# Altium project REB215_XPRO_A.PrjPCB
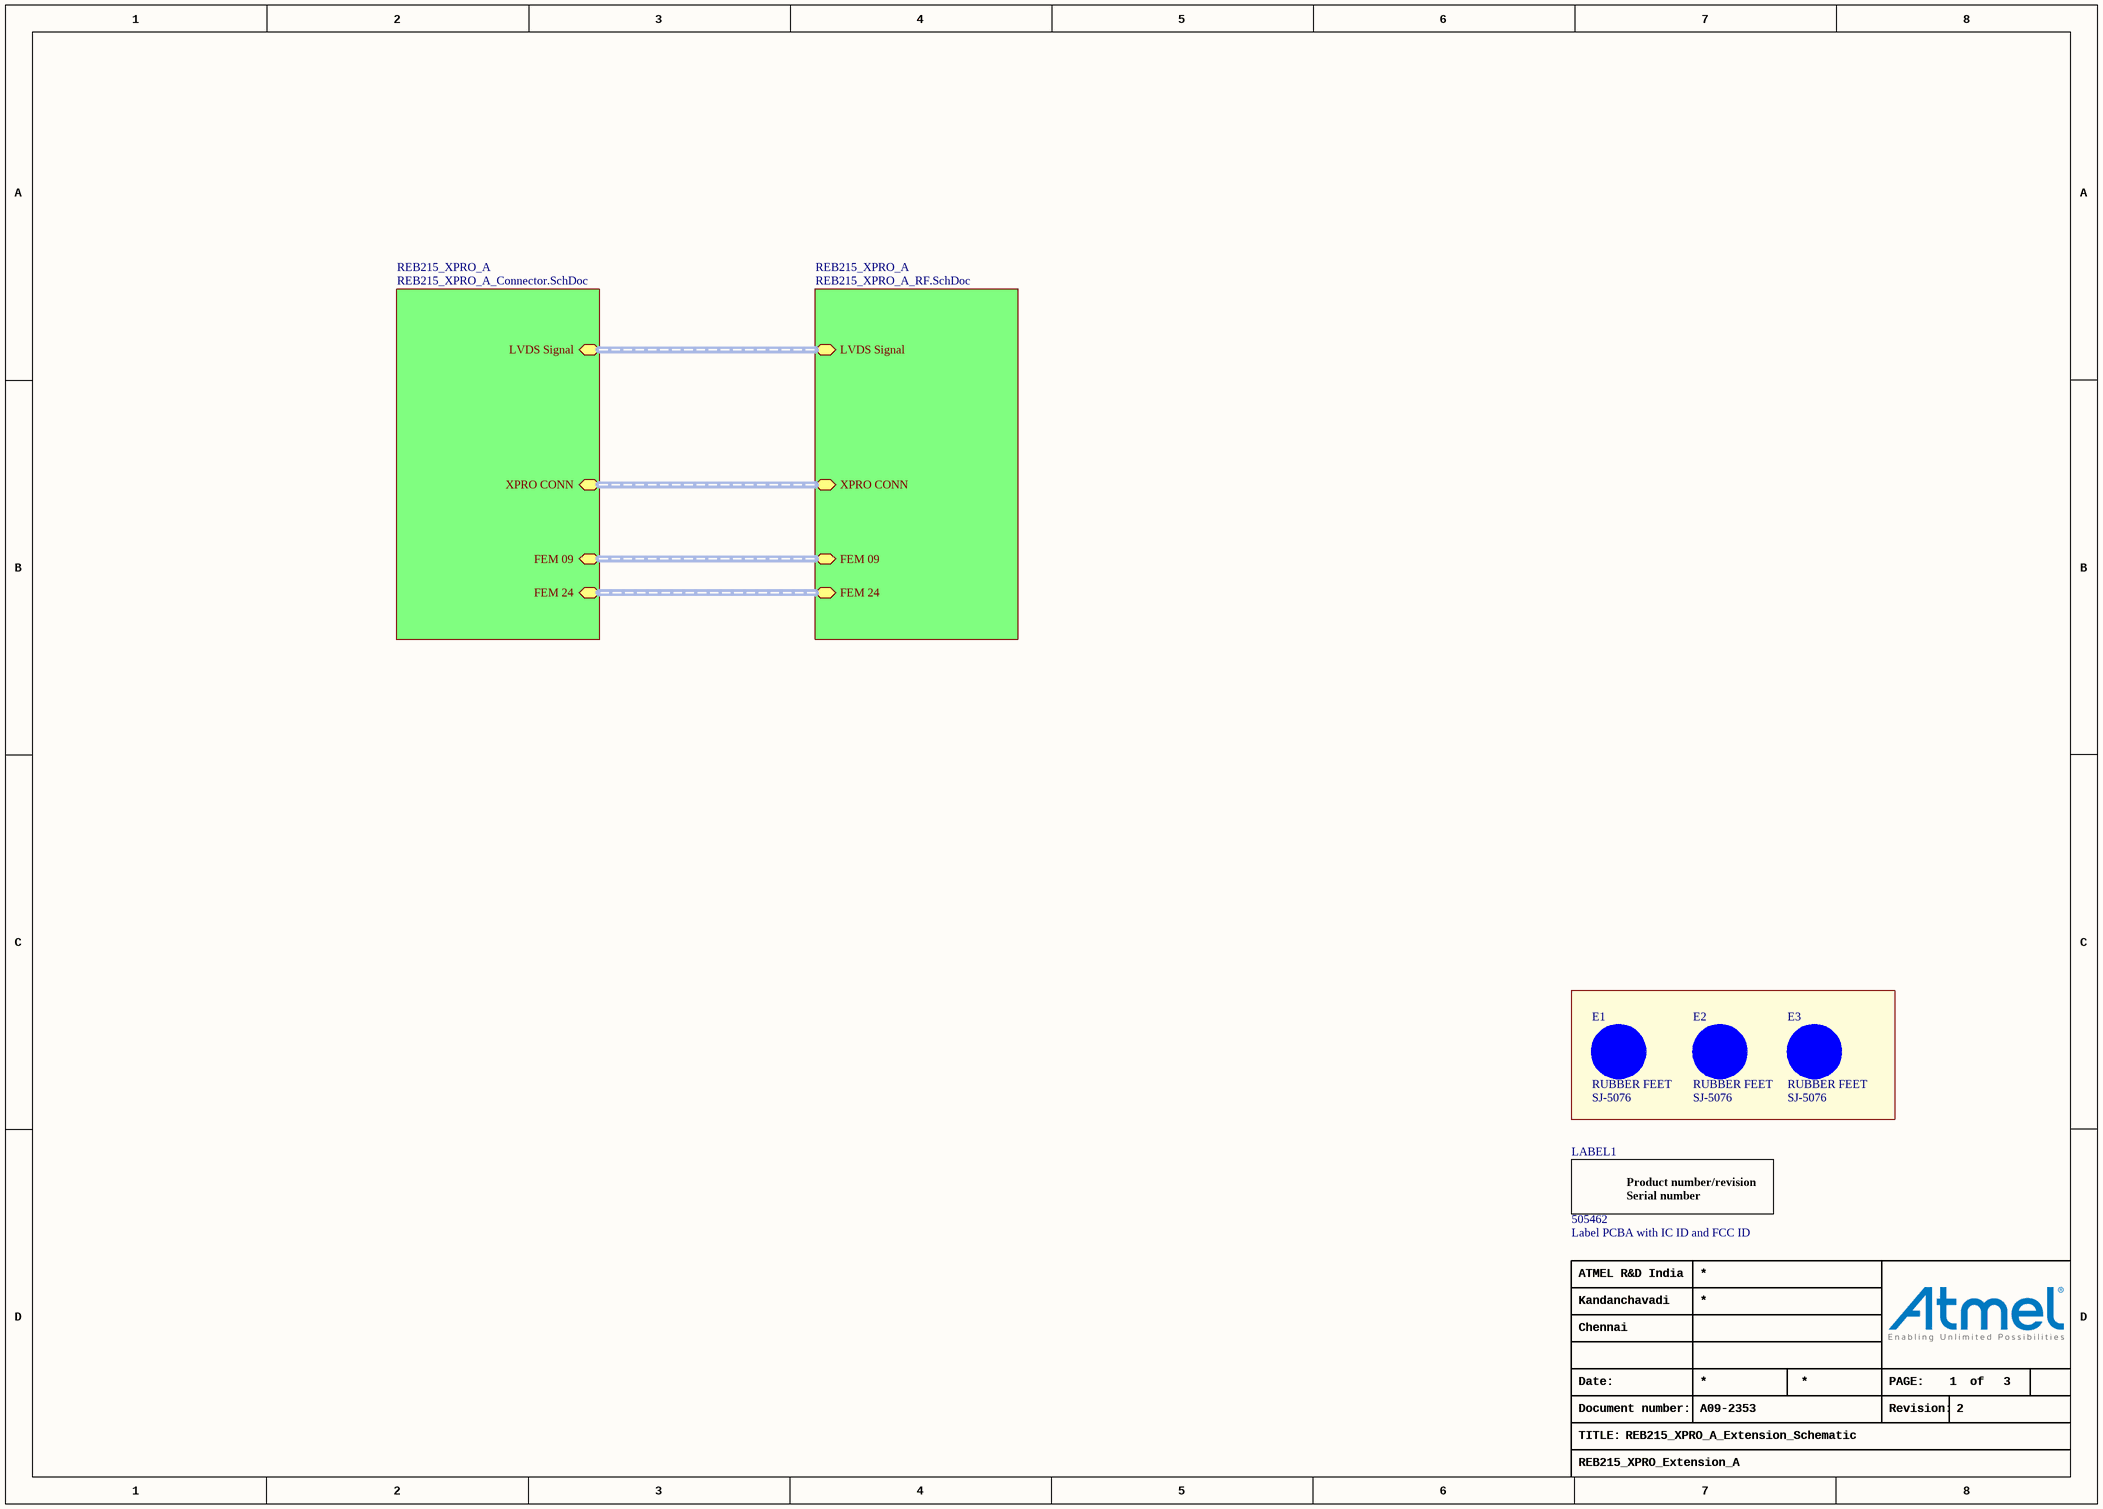
[diagram p0: REB215_XPRO_A_TopLevel.SchDoc]
3 sheets, 79 parts. Net scope: hierarchical (ports join the sheet entries above them; power ports are global).
Board file: REB215_XPRO_A.PcbDoc
Sheets:
  REB215_XPRO_A_TopLevel.SchDoc
    REB215_XPRO_A = REB215_XPRO_A_Connector.SchDoc
    REB215_XPRO_A = REB215_XPRO_A_RF.SchDoc

## Sheet REB215_XPRO_A_TopLevel.SchDoc: REB215_XPRO_A_Extension_Schematic
size A3; Organization: ATMEL R&D India; Address1: Kandanchavadi; Address2: Chennai; DocumentNumber: A09-2353; Revision: 2; SheetNumber: 1; SheetTotal: 3; PageSetup: Record=PageOptions|CenterHorizontal=True|CenterVertical=True|PrintScale=1.01|XCorrection=1.00|YCorrection=1.00|PrintKind=1|BorderSize=5000000|LeftOffset=0|BottomOffset=0|Orientation=2|PaperLength=1000|PaperWidth=1000|Scale=100|PaperSource=7|PrintQuality=-4|MediaType=1|DitherType=10|PaperKind=Letter|PrintScaleMode=1; DocumentName: REB215_XPRO_Extension_A

### Parts
E1  RUBBER FEET  value SJ-5076  [AP8-00192]
E2  RUBBER FEET  value SJ-5076  [AP8-00192]
E3  RUBBER FEET  value SJ-5076  [AP8-00192]
LABEL1  Label PCBA with IC ID and FCC ID  value 505462  [AP8-00317]  (mechanical)

### Sub-sheets
REB215_XPRO_A = REB215_XPRO_A_Connector.SchDoc: LVDS Signal (harness LVDS Signal), XPRO CONN (harness XPRO CONN), FEM 09 (harness FEM 09), FEM 24 (harness FEM 24)
REB215_XPRO_A = REB215_XPRO_A_RF.SchDoc: LVDS Signal (harness LVDS Signal), XPRO CONN (harness XPRO CONN), FEM 09, FEM 24

### Nets

Not connected (* = marked no-connect by the designer): E1 1(FIDUCIAL); E2 1(FIDUCIAL); E3 1(FIDUCIAL)

### Notes on the sheet
- Date:
- PAGE:
- of
- TITLE:
- Document number:
- Revision:
- (in symbol A08-1825) / Product number/revision / Serial number

### Library data of the parts
E1-E3 = A08-0053: 2.8mm adhesive feet,diam 8.0mm; PartGroup: Mechanical devices,Mounting accessories; Manufacturer: 3M; ComponentStatus: 'Active (verified)'; Verified date: 2006-05-05; Verified by: Ketil Skjerve; Status: Active; AN: A08-0053; Height: 2.79999995231628; MPN: SJ-5076; FootprintStatus: 'Active (Verified)'
LABEL1 = A08-1825: Label for use on wireless PCBA that needs IC ID and FCC ID; PartGroup: Mechanical devices,Packaging materials,Printed Labels; Manufacturer: ACT Logimark AS; ComponentStatus: 'Active (verified)'; AN: A08-1825; MPN: 505462; FootprintStatus: 'Active (Verified)'

## Sheet REB215_XPRO_A_Connector.SchDoc: REB215_XPRO_A_Extension_Schematic
size A3; Organization: ATMEL R&D India; Address1: Kandanchavadi; Address3: Chennai; DocumentNumber: A09-2353; Revision: 2; SheetNumber: 2; SheetTotal: 3; PageSetup: Record=PageOptions|CenterHorizontal=True|CenterVertical=True|PrintScale=1.01|XCorrection=1.00|YCorrection=1.00|PrintKind=1|BorderSize=5000000|LeftOffset=0|BottomOffset=0|Orientation=2|PaperLength=1000|PaperWidth=1000|Scale=100|PaperSource=7|PrintQuality=-4|MediaType=1|DitherType=10|PaperKind=A3 (297 x 420 mm)|PrintScaleMode=1; DocumentName: REB215_XPRO_Extension_A
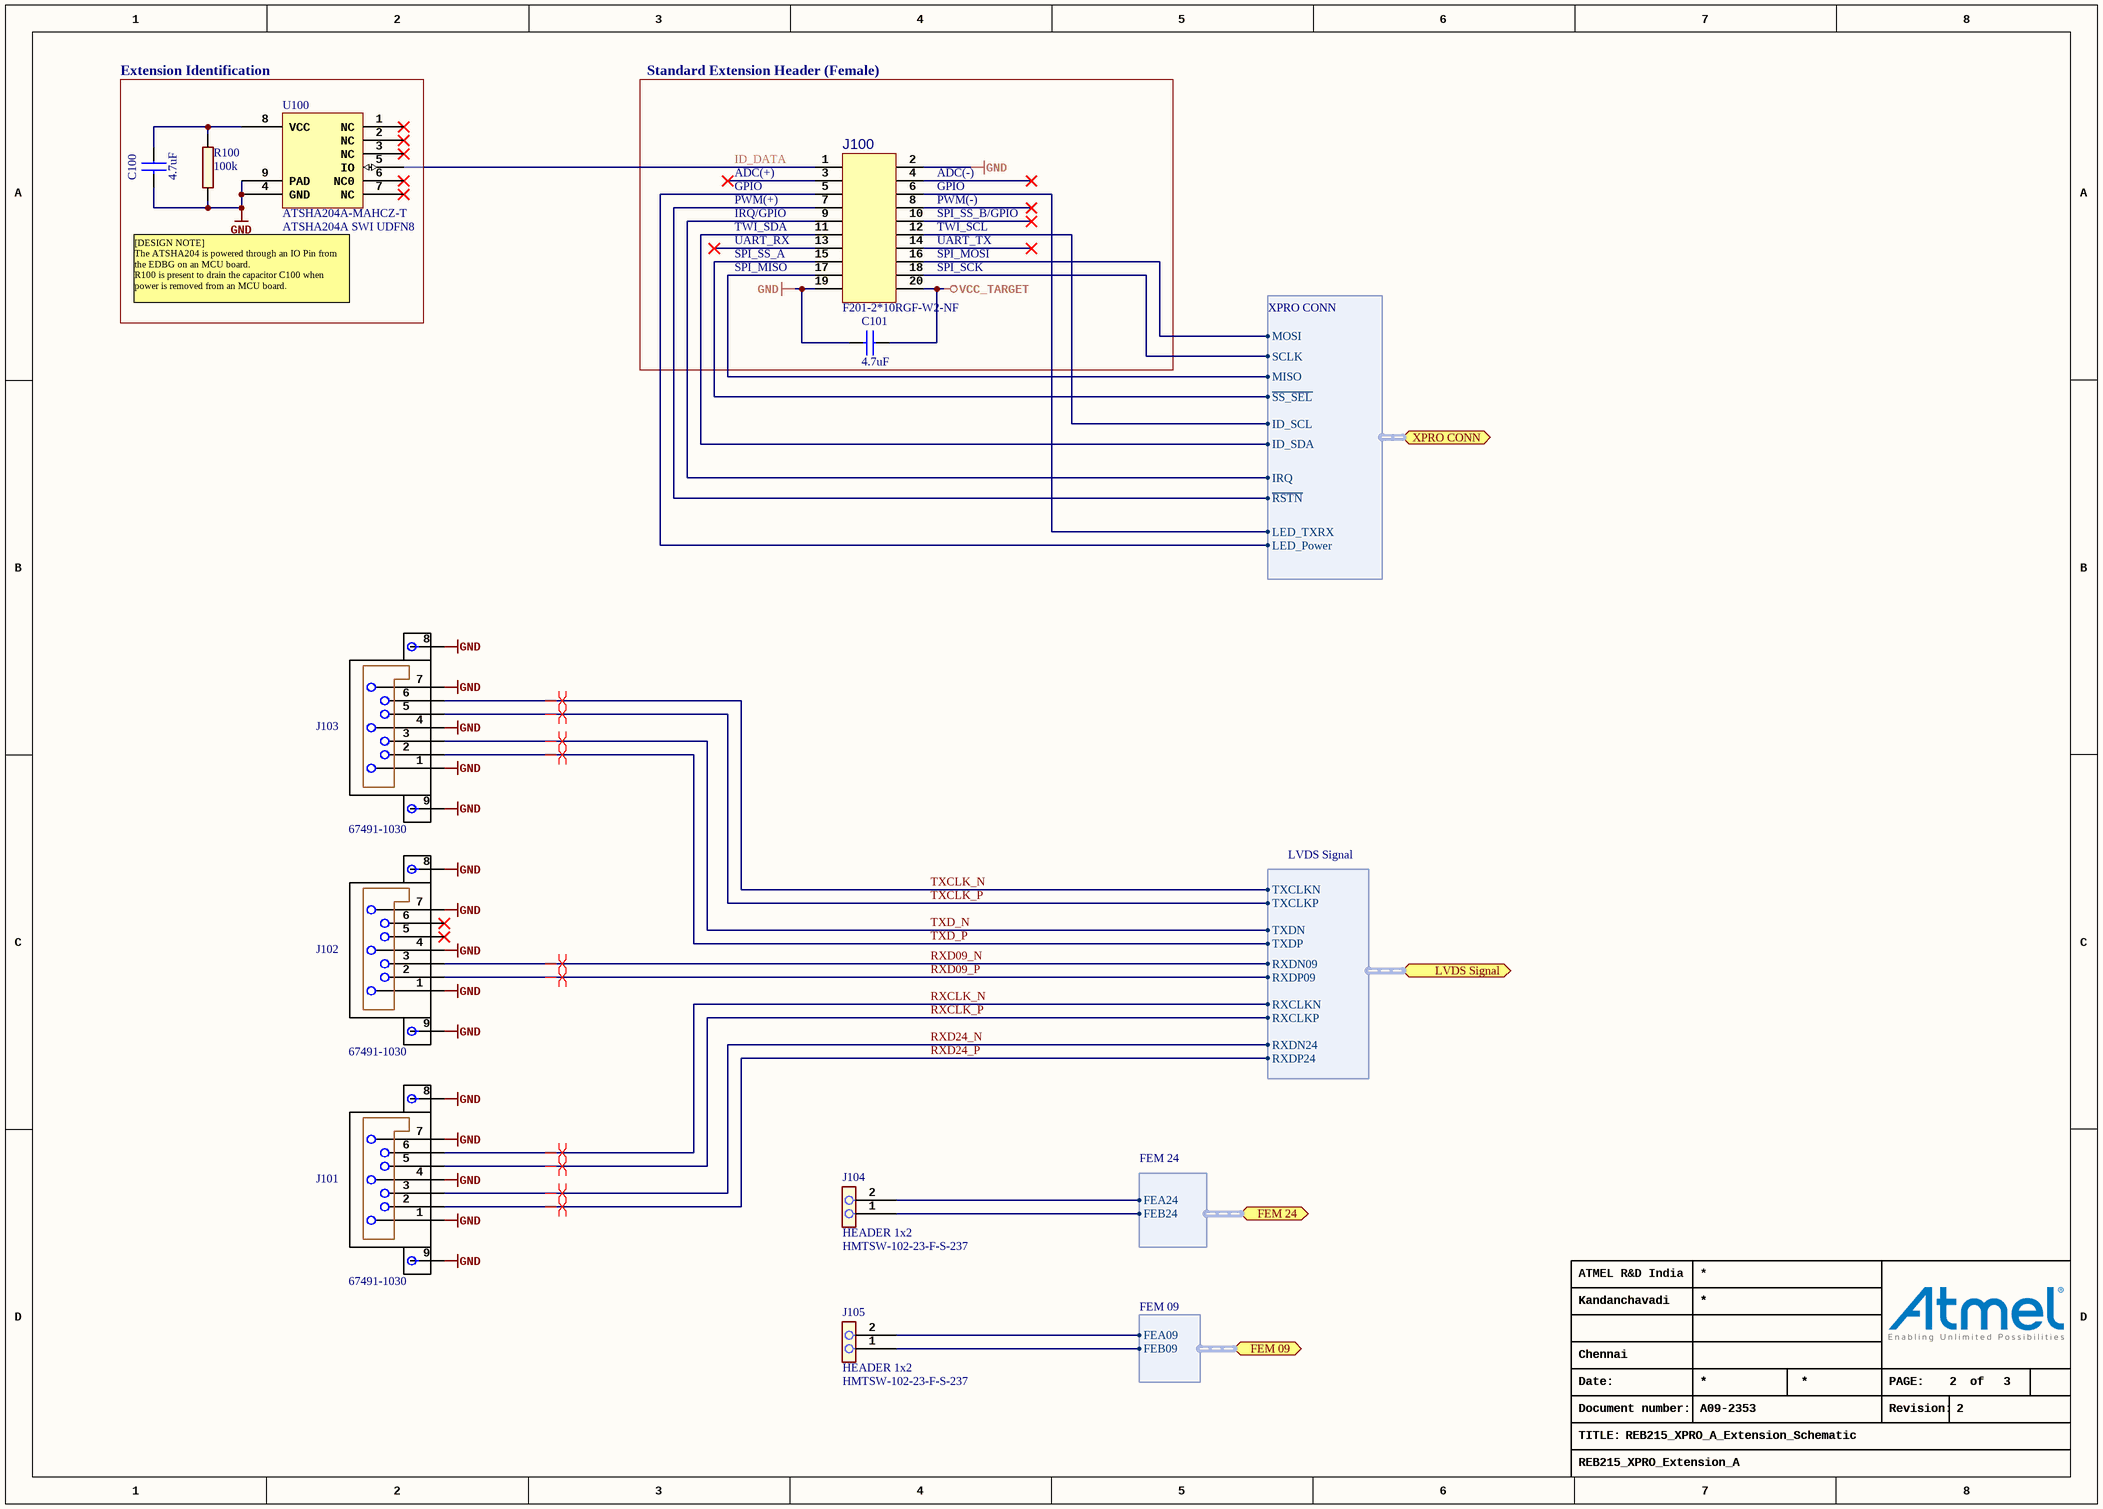
[diagram p1: REB215_XPRO_A_Connector.SchDoc]

### Parts
C100  value 4.7uF  [AP1-00001]  (hidden comment: Recommended by Escatec. No datasheet available yet.)
C101  value 4.7uF  [AP1-00001]  (hidden comment: Recommended by Escatec. No datasheet available yet.)
J100  value F201-2*10RGF-W2-NF  [AP8-00621]  (hidden comment: HEADER-2X10)
J101  value 67491-1030  [AP8-00746]  (hidden comment: SATA_7PIN_HEADER)
J102  value 67491-1030  [AP8-00746]  (hidden comment: SATA_7PIN_HEADER)
J103  value 67491-1030  [AP8-00746]  (hidden comment: SATA_7PIN_HEADER)
J104  HEADER 1x2  value HMTSW-102-23-F-S-237  [AP8-00733]
J105  HEADER 1x2  value HMTSW-102-23-F-S-237  [AP8-00733]
R100  value 100k  [AP2-00000]  (hidden comment: R2)
U100  ATSHA204A-MAHCZ-T  value ATSHA204A SWI UDFN8  [AP6-00409]

### Blocks framed on the sheet
Extension Identification: C100 R100 U100
Standard Extension Header (Female): C101 J100

### Ports
FEM 09 (harness FEM 09), FEM 24 (harness FEM 24), LVDS Signal (harness LVDS Signal), XPRO CONN (harness XPRO CONN)

### Harnesses
XPRO CONN: ID_SCL, ID_SDA, ~{SS_SEL}, MOSI, MISO, SCLK, ~{RSTN}, IRQ, LED_Power, LED_TXRX
FEM 24: FEA24, FEB24
FEM 09: FEA09, FEB09
LVDS Signal: TXCLKN, TXCLKP, TXDN, TXDP, RXDN09, RXDP09, RXCLKN, RXCLKP, RXDN24, RXDP24

### Nets
GND: C100.2 C101.2 J100.2 J100.19 J101.1 J101.4 J101.7 J101.8 J101.9 J102.1 J102.4 J102.7 J102.8 J102.9 J103.1 J103.4 J103.7 J103.8 J103.9 R100.1 U100.4(GND) U100.9(PAD)
VCC_TARGET: C101.1 J100.20
ID_DATA: J100.1 U100.5(IO)
ID_SCL: J100.12 ; port XPRO CONN.ID_SCL
ID_SDA: J100.11 ; port XPRO CONN.ID_SDA
RXCLK_N: J101.6 ; port LVDS Signal.RXCLKN
RXCLK_P: J101.5 ; port LVDS Signal.RXCLKP
RXD09_N: J102.3 ; port LVDS Signal.RXDN09
RXD09_P: J102.2 ; port LVDS Signal.RXDP09
RXD24_N: J101.3 ; port LVDS Signal.RXDN24
RXD24_P: J101.2 ; port LVDS Signal.RXDP24
TXCLK_N: J103.6 ; port LVDS Signal.TXCLKN
TXCLK_P: J103.5 ; port LVDS Signal.TXCLKP
TXD_N: J103.3 ; port LVDS Signal.TXDN
TXD_P: J103.2 ; port LVDS Signal.TXDP
NetC6_1: J100.7 ; port XPRO CONN.~{RSTN}
NetC100_1: C100.1 R100.2 U100.8(VCC)
NetJ100_5: J100.5 ; port XPRO CONN.LED_Power
NetJ100_6: J100.6 ; port XPRO CONN.LED_TXRX
NetJ100_9: J100.9 ; port XPRO CONN.IRQ
NetJ100_15: J100.15 ; port XPRO CONN.~{SS_SEL}
NetJ100_16: J100.16 ; port XPRO CONN.MOSI
NetJ100_17: J100.17 ; port XPRO CONN.MISO
NetJ100_18: J100.18 ; port XPRO CONN.SCLK
NetJ104_1: J104.1 ; port FEM 24.FEB24
NetJ104_2: J104.2 ; port FEM 24.FEA24
NetJ105_1: J105.1 ; port FEM 09.FEB09
NetJ105_2: J105.2 ; port FEM 09.FEA09

Not connected (* = marked no-connect by the designer): J100 3* 4* 8* 10* 13* 14*; J102 5* 6*; U100 1(NC)* 2(NC)* 3(NC)* 6(NC0)* 7(NC)*

### Layout directives
differential pair: RXCLK_N, RXCLK_P, RXD09_N, RXD09_P, RXD24_N, RXD24_P, TXCLK_N, TXCLK_P, TXD_N, TXD_P

### Notes on the sheet
- ADC(+)
- (near J100) ADC(-)
- PWM(+)
- GPIO
- TWI_SDA
- UART_RX
- IRQ/GPIO
- (near J100) PWM(-)
- (near J100) GPIO
- (near J100) TWI_SCL
- (near J100) UART_TX
- (near J100) SPI_SS_B/GPIO
- [DESIGN NOTE]
  The ATSHA204 is powered through an IO Pin from the EDBG on an MCU board.
  R100 is present to drain the capacitor C100 when power is removed from an MCU board.
- SPI_SS_A
- SPI_MISO
- (near J100) SPI_MOSI
- (near J100) SPI_SCK
- Date:
- PAGE:
- of
- TITLE:
- Document number:
- Revision:

### Library data of the parts
C100 C101 = A01-0347: Ceramic capacitor, SMD 0402, X5R, 6.3V, +/-20% (de33687); PartGroup: Capacitors,Ceramic,SMD 0402; Manufacturer: Murata; MPN: GRM155R60J475ME87D; Tolerance: +-20%; TemperatureRange: -55°C to +85°C; ComponentStatus: 'Active (verified)'; Status: Active; Verified by: Lars Helge Mo; Verified date: 2005-12-15; AN: A01-0347; Height: 0,5; FootprintStatus: 'Active (Verified)'
J100 = A08-1512: 2x10, female pin header receptable, right-angled, 2.54mm pitch, THM, Pin In Paste; PartGroup: Mechanical devices,Connectors,Pin header receptacle; Manufacturer: Pro-data International Corp; ComponentStatus: 'Active (verified)'; Verified by: *; Verified date: *; AN: A08-1512; Height: 5.07999992370605; MPN: F201-2*10RGF-W2-NF; FootprintStatus: 'Active (Verified)'
J101-J103 = A08-1789: 1.27mm Pitch Serial ATA High Speed Header, Through Hole, Vertical, 7 Circuits; PartGroup: Mechanical devices,Connectors,Memory cards; Manufacturer: Molex; ComponentStatus: 'Active (verified)'; Status: Valid; Verified by: vlarsen; Verified date: 2011-06-01; AN: A08-1789; Height: 8.39999961853027; MPN: 67491-1030; FootprintStatus: 'New (Not verified)'
J104 J105 = A08-1754: 1x2 pin header, 2.54mm pitch, Pin-in-Paste THM; PartGroup: Mechanical devices,Connectors,Pin headers; Manufacturer: SAMTEC; TemperatureRange: - 55 deg C to + 125 deg C; ComponentStatus: 'Active (verified)'; Verified date: 2006-01-30; Verified by: Lars Helge; Status: Active; AN: A08-1754; Height: 6.09999990463257; MPN: HMTSW-102-23-F-S-237; FootprintStatus: 'Active (Verified)'
R100 = A02-0260: Thick film resistor, SMD 0402, 1/16W, 1%; PartGroup: Resistors,SMD,0402 1%; TemperatureRange: -55ï¿½ to +125ï¿½C; ComponentStatus: 'Active (verified)'; Status: Active; Verified by: Lars Helge Mo; Verified date: 2005-12-19; AN: A02-0260; Tolerance: 1 %; Height: 0.349999994039536; FootprintStatus: 'Active (Verified)'
U100 = A06-1276: ATSHA204A with 1-wire interface and UDFN8 package; PartGroup: Integrated Circuits,Special function,Encryption; Manufacturer: ATMEL; ComponentStatus: 'Active (verified)'; Status: New; Verified by: VL; Verified date: 2015-01-27; AN: A06-1276; Height: 0.600000023841858; MPN: ATSHA204A-MAHCZ-T; FootprintStatus: 'Active (Verified)'

## Sheet REB215_XPRO_A_RF.SchDoc: REB215_XPRO_A_Extension_Schematic
size A3; Organization: ATMEL R&D India; Address1: Kandanchavadi; Address2: Chennai; DocumentNumber: A09-2353; Revision: 2; SheetNumber: 3; SheetTotal: 3; PageSetup: Record=PageOptions|CenterHorizontal=True|CenterVertical=True|PrintScale=1.01|XCorrection=1.00|YCorrection=1.00|PrintKind=1|BorderSize=5000000|LeftOffset=0|BottomOffset=0|Orientation=2|PaperLength=1000|PaperWidth=1000|Scale=100|PaperSource=7|PrintQuality=-4|MediaType=1|DitherType=10|PaperKind=A3 (297 x 420 mm)|PrintScaleMode=1; DocumentName: REB215_XPRO_Extension_A
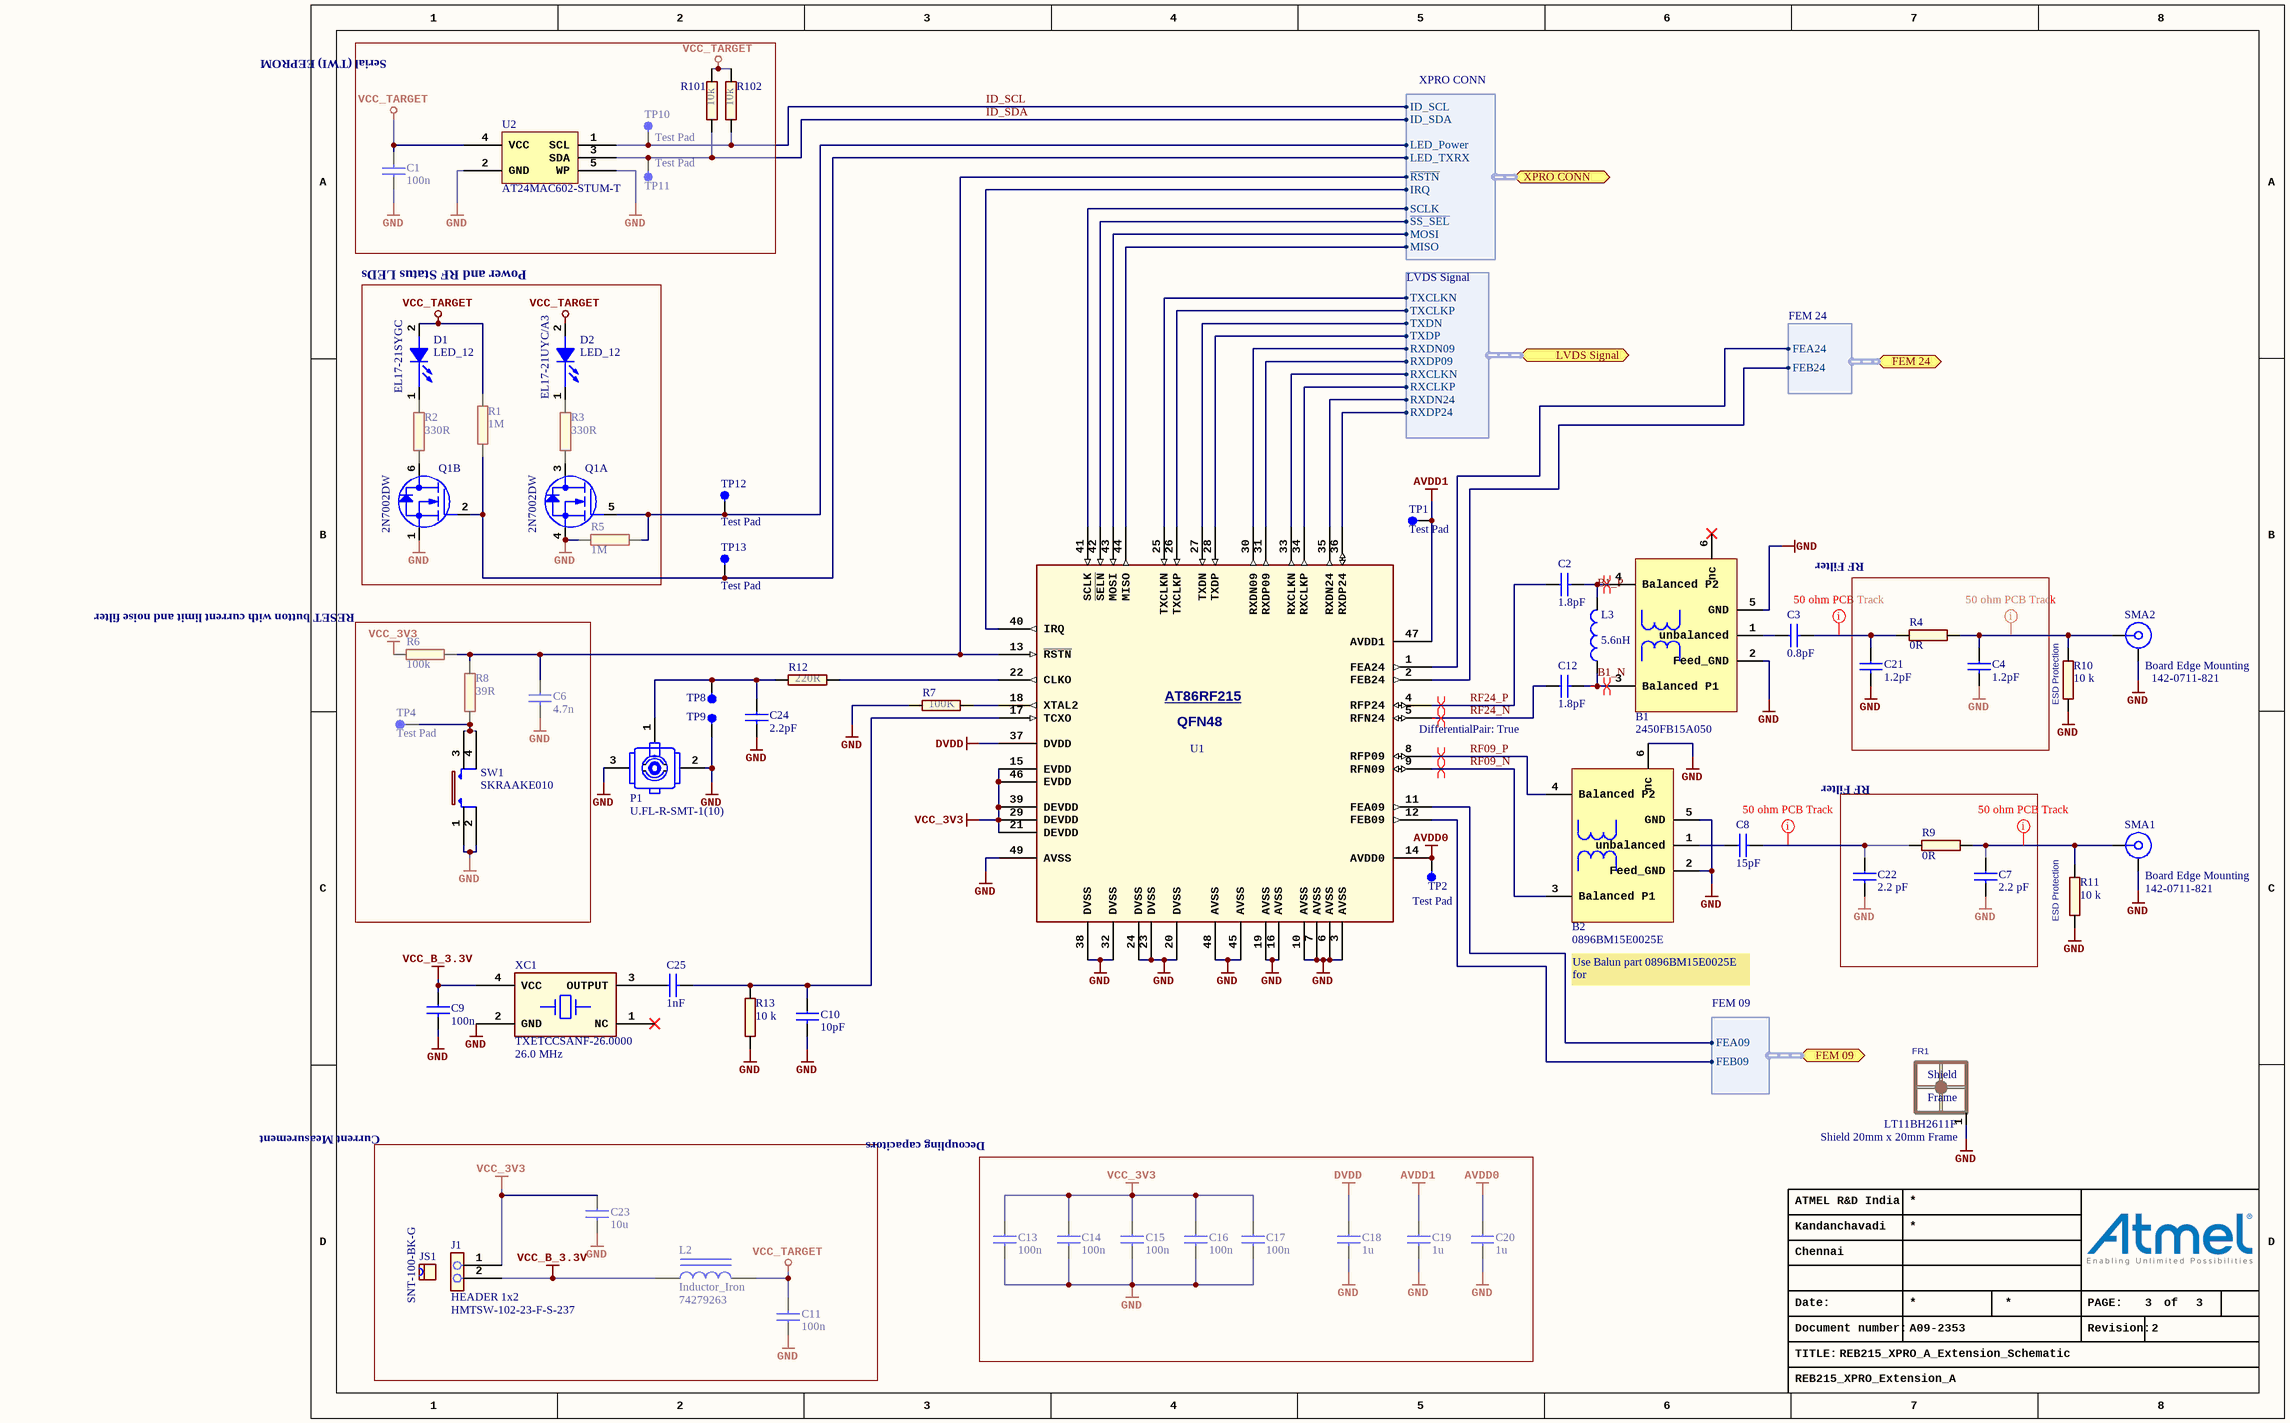
[diagram p2: REB215_XPRO_A_RF.SchDoc]

### Parts
B1  value 2450FB15A050  [AP3-00060]  (hidden comment: Balun_2.4GHz)
B2  value 0896BM15E0025E  [AP3-00060]  (hidden comment: Balun_2.4GHz)
C1  value 100n  [AP1-00001]  (hidden comment: CAP-NONPOL)
C2  value 1.8pF  [AP1-00035]  (hidden comment: CAP-NONPOL)
C3  value 0.8pF  [AP1-00035]  (hidden comment: CAP-NONPOL)
C4  value 1.2pF  [AP1-00035]  (hidden comment: This 1.2pF capacitor is used for RF antennae tuning and can not be replaced by alternatives.)
C6  value 4.7n  [AP1-00001]  (hidden comment: CAP-NONPOL)
C7  value 2.2 pF  [AP1-00032]  (hidden comment: C0G, NP0)
C8  value 15pF  [AP1-00032]  (hidden comment: CAP-NONPOL)
C9  value 100n  [AP1-00001]  (hidden comment: CAP-NONPOL)
C10  value 10pF  [AP1-00032]  (hidden comment: High Temp version)
C11  value 100n  [AP1-00001]  (hidden comment: CAP-NONPOL)
C12  value 1.8pF  [AP1-00035]  (hidden comment: CAP-NONPOL)
C13  value 100n  [AP1-00001]  (hidden comment: CAP-NONPOL)
C14  value 100n  [AP1-00001]  (hidden comment: CAP-NONPOL)
C15  value 100n  [AP1-00001]  (hidden comment: CAP-NONPOL)
C16  value 100n  [AP1-00001]  (hidden comment: CAP-NONPOL)
C17  value 100n  [AP1-00001]  (hidden comment: CAP-NONPOL)
C18  value 1u  [AP1-00001]  (hidden comment: CAP-NONPOL)
C19  value 1u  [AP1-00001]  (hidden comment: CAP-NONPOL)
C20  value 1u  [AP1-00001]  (hidden comment: CAP-NONPOL)
C21  value 1.2pF  [AP1-00035]  (hidden comment: This 1.2pF capacitor is used for RF antennae tuning and can not be replaced by alternatives.)
C22  value 2.2 pF  [AP1-00032]  (hidden comment: C0G, NP0)
C23  value 10u  [AP1-00026]  (hidden comment: CAP-NONPOL)
C24  value 2.2pF  [AP1-00038]  (hidden comment: CAP-NONPOL)
C25  value 1nF  [AP1-00035]  (hidden comment: Alternate PN GRM033R71C102KA01D  is good, but for Rated Voltage)
D1  LED_12  value EL17-21SYGC  [AP4-00013]
D2  LED_12  value EL17-21UYC/A3  [AP4-00013]
FR1  Shield 20mm x 20mm Frame  value LT11BH2611F  [AP8-00753]
J1  HEADER 1x2  value HMTSW-102-23-F-S-237  [AP8-00733]
JS1  value SNT-100-BK-G  [AP8-00525]  (hidden comment: To be used by request from ESCATEC)
L2  Inductor_Iron  value 74279263  [AP3-00049]
L3  value 5.6nH  [AP3-00041]  (hidden comment: ceramic chip inductor, 5.6nH, 0201)
P1  value U.FL-R-SMT-1(10)  [AP8-00380]  (hidden comment: Copy of A08-0629)
Q1  value 2N7002DW  [AP5-00001]  (hidden comment: Same as 2N7002 but with two MOSFETs in one package)  (parts A,B of 2)
R1  value 1M  [AP2-00000]  (hidden comment: R2)
R2  value 330R  [AP2-00000]  (hidden comment: R2)
R3  value 330R  [AP2-00000]  (hidden comment: R2)
R4  value 0R  [AP2-00028]  (hidden comment: Copy of A02-0534)
R5  value 1M  [AP2-00000]  (hidden comment: R2)
R6  value 100k  [AP2-00000]  (hidden comment: R2)
R7  value 100K  [AP2-00028]  (hidden comment: R2)
R8  value 39R  [AP2-00000]  (hidden comment: R2)
R9  value 0R  [AP2-00028]  (hidden comment: Copy of A02-0534)
R10  value 10 k  [AP2-00028]  (hidden comment: Copy of A02-0535)
R11  value 10 k  [AP2-00028]  (hidden comment: Copy of A02-0535)
R12  value 220R  [AP2-00000]  (hidden comment: R2)
R13  value 10 k  [AP2-00028]  (hidden comment: Copy of A02-0535)
R101  value 10k  [AP2-00000]  (hidden comment: R2)
R102  value 10k  [AP2-00000]  (hidden comment: R2)
SMA1  Board Edge Mounting  value 142-0711-821  [AP8-00443]
SMA2  Board Edge Mounting  value 142-0711-821  [AP8-00443]
SW1  value SKRAAKE010  [AP8-00137]  (hidden comment: same as A08-0091 but less force is needed; Can be ordered in low volumes from Mouser)
TP1  value Test Pad  [AP8-00399]  (hidden comment: TESTPOINT)  (no BOM)
TP2  value Test Pad  [AP8-00399]  (hidden comment: TESTPOINT)  (no BOM)
TP4  value Test Pad  [AP8-00399]  (hidden comment: TESTPOINT)  (no BOM)
TP8  Mounting hole dia should be 1.6mm. Refer A08-2059  [AP8-00710]  (value not drawn)  (no BOM)
TP9  Mounting hole dia should be 1.6mm. Refer A08-2059  [AP8-00710]  (value not drawn)  (no BOM)
TP10  value Test Pad  [AP8-00399]  (hidden comment: TESTPOINT)  (no BOM)
TP11  value Test Pad  [AP8-00399]  (hidden comment: TESTPOINT)  (no BOM)
TP12  value Test Pad  [AP8-00399]  (hidden comment: TESTPOINT)  (no BOM)
TP13  value Test Pad  [AP8-00399]  (hidden comment: TESTPOINT)  (no BOM)
U1  48 lead QFN package  [AP6-00345]  (value not drawn)
U2  value AT24MAC602-STUM-T  [AP6-00014]  (hidden comment: AT24MAC602)
XC1  TXETCCSANF-26.0000  value 26.0 MHz  [AP7-00060]

### Blocks framed on the sheet
Serial (TWI) EEPROM: C1 R101 R102 TP10 TP11 U2
RESET button with current limit and noise filter: C6 R6 R8 SW1 TP4
RF Filter: C7 C22 R9
Current Measurement: C11 C23 J1 JS1 L2

### Ports
FEM 09 (harness FEM 09), FEM 24 (harness FEM 24), LVDS Signal (harness LVDS Signal), XPRO CONN (harness XPRO CONN)

### Harnesses
XPRO CONN: ID_SCL, ID_SDA, ~{SS_SEL}, MOSI, MISO, SCLK, ~{RSTN}, IRQ, LED_Power, LED_TXRX
LVDS Signal: TXCLKN, TXCLKP, TXDN, TXDP, RXDN09, RXDP09, RXCLKN, RXCLKP, RXDN24, RXDP24
FEM 09: FEA09, FEB09
FEM 24: FEA24, FEB24

### Nets
AVDD0: C20.1 TP2.1 U1.14(AVDD0)
AVDD1: C19.1 TP1.1 U1.47(AVDD1)
DVDD: C18.1 U1.37(DVDD)
GND: B1.2(Feed_GND) B1.5(GND) B2.2(Feed_GND) B2.5(GND) B2.6(nc) C1.1 C4.2 C6.2 C7.2 C9.2 C10.2 C11.1 C13.2 C14.2 C15.2 C16.2 C17.2 C18.2 C19.2 C20.2 C21.2 C22.2 C23.2 C24.2 FR1.1(GND) P1.2(GND) P1.3(GND) Q1.1(S2) Q1.4(S1) R5.2 R7.2 R10.1 R11.1 R13.1 SMA1.2 SMA2.2 SW1.1 SW1.2 TP9.1 U1.3(AVSS) U1.6(AVSS) U1.7(AVSS) U1.10(AVSS) U1.16(AVSS) U1.19(AVSS) U1.20(DVSS) U1.23(DVSS) U1.24(DVSS) U1.32(DVSS) U1.38(DVSS) U1.45(AVSS) U1.48(AVSS) U1.49(AVSS) U2.2(GND) U2.5(WP) XC1.2(GND)
VCC_3V3: C13.1 C14.1 C15.1 C16.1 C17.1 C23.1 J1.1 R6.2 U1.15(EVDD) U1.21(DEVDD) U1.29(DEVDD) U1.39(DEVDD) U1.46(EVDD)
VCC_B_3.3V: C9.1 J1.2 L2.1 XC1.4(VCC)
VCC_TARGET: C1.2 C11.2 D1.2(ANODE) D2.2(ANODE) L2.2 R1.2 R101.2 R102.2 U2.4(VCC)
B1_N: B1.3(Balanced_P1) C12.2 L3.1
B1_P: B1.4(Balanced_P2) C2.2 L3.2
ID_SCL: R102.1 TP10.1 U2.1(SCL) ; port XPRO CONN.ID_SCL
ID_SDA: R101.1 TP11.1 U2.3(SDA) ; port XPRO CONN.ID_SDA
RF09_N: B2.3(Balanced_P1) U1.9(RFN09)
RF09_P: B2.4(Balanced_P2) U1.8(RFP09)
RF24_N: C12.1 U1.5(RFN24)
RF24_P: C2.1 U1.4(RFP24)
RXCLK_N: U1.33(RXCLKN) ; port LVDS Signal.RXCLKN
RXCLK_P: U1.34(RXCLKP) ; port LVDS Signal.RXCLKP
RXD09_N: U1.30(RXDN09) ; port LVDS Signal.RXDN09
RXD09_P: U1.31(RXDP09) ; port LVDS Signal.RXDP09
RXD24_N: U1.35(RXDN24) ; port LVDS Signal.RXDN24
RXD24_P: U1.36(RXDP24) ; port LVDS Signal.RXDP24
TXCLK_N: U1.25(TXCLKN) ; port LVDS Signal.TXCLKN
TXCLK_P: U1.26(TXCLKP) ; port LVDS Signal.TXCLKP
TXD_N: U1.27(TXDN) ; port LVDS Signal.TXDN
TXD_P: U1.28(TXDP) ; port LVDS Signal.TXDP
NetB1_1: B1.1(unbalanced) C3.1
NetB2_1: B2.1(unbalanced) C8.1
NetC3_2: C3.2 C21.1 R4.1
NetC4_1: C4.1 R4.2 R10.2 SMA2.1
NetC6_1: C6.1 R6.1 R8.2 U1.13(~{RSTN}) ; port XPRO CONN.~{RSTN}
NetC7_1: C7.1 R9.2 R11.2 SMA1.1
NetC8_2: C8.2 C22.1 R9.1
NetC10_1: C10.1 C25.2 R13.2 U1.17(TCXO)
NetC24_1: C24.1 P1.1(SIG) R12.1 TP8.1
NetC25_1: C25.1 XC1.3(OUTPUT)
NetD1_1: D1.1(CATHODE) R2.2
NetD2_1: D2.1(CATHODE) R3.2
NetJ100_5: Q1.5(G1) R5.1 TP12.1 ; port XPRO CONN.LED_Power
NetJ100_6: Q1.2(G2) R1.1 TP13.1 ; port XPRO CONN.LED_TXRX
NetJ100_9: U1.40(IRQ) ; port XPRO CONN.IRQ
NetJ100_15: U1.42(~{SELN}) ; port XPRO CONN.~{SS_SEL}
NetJ100_16: U1.43(MOSI) ; port XPRO CONN.MOSI
NetJ100_17: U1.44(MISO) ; port XPRO CONN.MISO
NetJ100_18: U1.41(SCLK) ; port XPRO CONN.SCLK
NetJ104_1: U1.2(FEB24) ; port FEM 24.FEB24
NetJ104_2: U1.1(FEA24) ; port FEM 24.FEA24
NetJ105_1: U1.12(FEB09) ; port FEM 09.FEB09
NetJ105_2: U1.11(FEA09) ; port FEM 09.FEA09
NetQ1_3: Q1.3(D1) R3.1
NetQ1_6: Q1.6(D2) R2.1
NetR7_1: R7.1 U1.18(XTAL2)
NetR8_1: R8.1 SW1.3 SW1.4 TP4.1
NetR12_2: R12.2 U1.22(CLKO)

Not connected (* = marked no-connect by the designer): B1 6(nc)*; XC1 1(NC)*

### Layout directives
differential pair: (no net found under the mark), B1_N, B1_P
mark named 50 ohm PCB Track: NetC3_2, NetC4_1, NetC7_1, NetC8_2

### Notes on the sheet
- Power and RF Status LEDs
- RF Filter
- (near R10) ESD Protection
- (near R11) ESD Protection
- Use Balun part 0896BM15E0025E for
  sub-1 GHz bands (863 - 928MHz)
- Decoupling capacitors
- Labels drawn without touching a wire or pin: GND
- Date:
- PAGE:
- of
- TITLE:
- Document number:
- Revision:
- (in symbol A06-0976) QFN48
- (in symbol A08-1821) Shield; Frame

### Library data of the parts
B1 = A03-0130: 2.45 GHz Balun / Filter Combination; PartGroup: Inductors,RF,Other RF; Manufacturer: Johanson Technology; TemperatureRange: -40 to +85; ComponentStatus: 'Active (verified)'; AN: A03-0130; Height: 1; MPN: 2450FB15A050; FootprintStatus: 'Active (Verified)'
B2 = A03-0235: 863/915 MHz ISM band Balun+LPF for AT86RF215; PartGroup: Inductors,RF,Other RF; Manufacturer: Johanson Technology; ComponentStatus: 'Active (verified)'; AN: A03-0235; Height: 1; MPN: 0896BM15E0025E; FootprintStatus: 'Active (Verified)'
C1 C9 C11 C13-C17 = A01-0246: Ceramic capacitor, SMD 0402, X7R, 16V, +/-10%; PartGroup: Capacitors,Ceramic,SMD 0402; Manufacturer: Kemet; MPN: C0402C104K4RACTU; TemperatureRange: -55 - +125 deg C; ComponentStatus: 'Active (verified)'; Status: Active; Verified by: Lars Helge Mo; Verified date: 2005-12-15; AN: A01-0246; Tolerance: 16V, +/-10%; Height: 0.5; FootprintStatus: 'Active (Verified)'
C2 C12 = A01-0682: CAP CER 1.8PF 25V NP0 0201; PartGroup: Capacitors,Ceramic,SMD 0201; Manufacturer: Johanson Technology; MPN: 250R05L1R8BT4T; Tolerance: Â±0.1pF; TemperatureRange: -55Â°C ~ 125Â°C; ComponentStatus: 'Active (verified)'; Status: Active; Verified by: Lars Helge Mo; Verified date: 2005-12-15; AN: A01-0682; FootprintStatus: 'Active (Verified)'
C3 = A01-0683: CAP CER 0.8PF 25V NP0 0201; PartGroup: Capacitors,Ceramic,SMD 0201; Manufacturer: Johanson Technology; MPN: 250R05L0R8AV4T; Tolerance: Â±0.05pF; TemperatureRange: -55Â°C ~ 125Â°C; ComponentStatus: 'Active (verified)'; Status: Active; Verified by: Lars Helge Mo; Verified date: 2005-12-15; AN: A01-0683; FootprintStatus: 'Active (Verified)'
C4 C21 = A01-0612: Ceramic Capacitor, SMD 0201, 25V, NP0, 1.2pF; PartGroup: Capacitors,Ceramic,SMD 0201; Manufacturer: Johanson Technology; MPN: 250R05L1R2CV4T; ComponentStatus: 'Active (verified)'; Status: Active; Verified by: Lars Helge Mo; Verified date: 2005-12-15; AN: A01-0612; FootprintStatus: 'Active (Verified)'
C6 = A01-0046: Ceramic capacitor, SMD 0402, X7R, 25V, +/-10% (de35287); PartGroup: Capacitors,Ceramic,SMD 0402; TemperatureRange: -55 - +125 deg C; ComponentStatus: 'Active (verified)'; Status: Active; Verified by: Lars Helge Mo; Verified date: 2005-12-15; AN: A01-0046; Tolerance: 25V, +/-10%; Height: 0.550000011920929; FootprintStatus: 'Active (Verified)'
C7 C22 = A01-0472: CAP CER 2.2PF 6.3V NP0 0201; PartGroup: Capacitors,Ceramic,SMD 0201; Manufacturer: Kemet; MPN: CBR02C229C9GAC; Tolerance: ±0.25pF; TemperatureRange: -55°C ~ 125°C; ComponentStatus: 'Active (verified)'; Status: Active; Verified by: Lars Helge Mo; Verified date: 2005-12-15; AN: A01-0472; Height: 0.300000011920929; FootprintStatus: 'Active (Verified)'
C8 = A01-0611: CAP CER 15PF 25V NP0 0201; PartGroup: Capacitors,Ceramic,SMD 0201; Manufacturer: Murata; MPN: GRM0335C1E150JA01D; Tolerance: Â±5%; TemperatureRange: -55Â°C to 125Â°C; ComponentStatus: 'Active (verified)'; Status: Active; Verified by: Lars Helge Mo; Verified date: 2005-12-15; AN: A01-0611; Height: 0.300000011920929; FootprintStatus: 'Active (Verified)'
C10 = A01-0581: CAP CER 10PF 25V Â±.25pf ( and Â±.30ppm/ degree C of temp variation) NP0 0201; PartGroup: Capacitors,Ceramic,SMD 0201; Manufacturer: tdk; MPN: C0603C0G1E100C; Tolerance: Â±20ppm to Â±50ppm; TemperatureRange: -55CÂº ~ +125ÂºC; ComponentStatus: 'Active (verified)'; Status: Active; Verified by: Lars Helge Mo; Verified date: 2005-12-15; AN: A01-0581; FootprintStatus: 'Active (Verified)'
C18-C20 = A01-0286: Ceramic capacitor, SMD 0402, X5R, 6.3V, +/-10% (de26942); PartGroup: Capacitors,Ceramic,SMD 0402; Manufacturer: Kemet; MPN: C0402C105K9PAC; TemperatureRange: -55 to 85 deg C; ComponentStatus: 'Active (verified)'; Status: Active; Verified by: Lars Helge Mo; Verified date: 2005-12-15; AN: A01-0286; Tolerance: +/-10%; Height: 0.5; FootprintStatus: 'Active (Verified)'
C23 = A01-0276: Ceramic capacitor, SMD 1206, X5R, 6.3V, ±10%; PartGroup: Capacitors,Ceramic,SMD 1206; Manufacturer: Murata; MPN: GRM319R60J106KE19; TemperatureRange: -55 to +125; ComponentStatus: 'Active (verified)'; Status: Active; Verified by: Lars Helge Mo; Verified date: 2005-12-15; AN: A01-0276; Tolerance: ±10%; Height: 0.850000023841858; FootprintStatus: 'Active (Verified)'
C24 = A01-0351: Ceramic capacitor, SMD 0402, NP0, 50V, +/-0.25pF (de23847); PartGroup: Capacitors,Ceramic,SMD 0402; Manufacturer: Murata; MPN: GRM1555C1H2R2CZ01D; Tolerance: 0,25pF; TemperatureRange: -55ï¿½C to +125ï¿½C; ComponentStatus: 'Active (verified)'; Status: Active; Verified by: Lars Helge Mo; Verified date: 2005-12-15; AN: A01-0351; FootprintStatus: 'Active (Verified)'
C25 = A01-0577: Ceramic capacitor, SMD 0201, X7R, 10V, +/-10%; PartGroup: Capacitors,Ceramic,SMD 0201; Manufacturer: Johanson Technology; MPN: 100R05W102KV4; ComponentStatus: 'Active (verified)'; Status: Active; Verified by: Lars Helge Mo; Verified date: 2005-12-15; AN: A01-0577; FootprintStatus: 'Active (Verified)'
D1 = A10-0018: LED, Green, Wave length=575nm, SMD 0805, ±70°; PartGroup: Opto,LEDs,SMD; Manufacturer: Everlight; TemperatureRange: -40 - +85 deg C; ComponentStatus: 'Active (verified)'; Verified date: 2006-02-17; Verified by: Sveinung Helgeland; Status: Active; AN: A10-0018; Height: 1.10000002384186; MPN: EL17-21SYGC; FootprintStatus: 'Active (Verified)'
D2 = A10-0019: LED, Yellow, Wave length=591nm, SMD 0805, ±70°; PartGroup: Opto,LEDs,SMD; Manufacturer: Everlight; MPN: 17-21UYC/S530-A3/TR8; TemperatureRange: -40 to +85 deg C; ComponentStatus: 'Active (verified)'; Verified date: 2006-02-17; Verified by: Sveinung Helgeland; Status: Active; AN: A10-0019; Height: 1.10000002384186; FootprintStatus: 'Active (Verified)'
FR1 = A08-1821: SMD frame for metal shield 20mm x 20mm (de34031); PartGroup: Mechanical devices,Enclosures,EMI shielding; Manufacturer: Laird Technologies; ComponentStatus: 'New (not verified)'; AN: A08-1821; Height: 3; MPN: LT11BH2611F; FootprintStatus: 'New (Not verified)'
J1 = A08-1754: as J104 on sheet REB215_XPRO_A_Connector; Verified date: 2006-01-30; Verified by: Lars Helge; Status: Active; AN: A08-1754; Height: 6.09999990463257; MPN: HMTSW-102-23-F-S-237; FootprintStatus: 'Active (Verified)'
JS1 = A08-0543: Jumper cap for 2.54mm pinheader; PartGroup: Mechanical devices,Mounting accessories,Other; Manufacturer: SAMTEC; ComponentStatus: 'Active (verified)'; Verified date: 2006-04-05; Verified by: Lars Helge Mo; Status: Active; AN: A08-0543; MPN: SNT-100-BK-G; FootprintStatus: 'Active (Verified)'
L2 = A03-0072: SMD-Ferrite 220Ohm, 100MHz 0603 size, (de14411); PartGroup: Inductors,EMI; Manufacturer: Wurth Elektronik; TemperatureRange: -55 - +125 deg C; ComponentStatus: 'Active (verified)'; AN: A03-0072; MPN: 74279263; FootprintStatus: 'Active (Verified)'
L3 = A03-0150: PartGroup: Inductors,RF,SMD 0201; Manufacturer: Johanson Technology; MPN: L-05B5N6SV6T; Tolerance: ±0.3nH; TemperatureRange: -40°C ~ 100°C; ComponentStatus: 'Active (verified)'; Verified date: 2006-01-30; Verified by: Lars Helge Mo; Status: Active; AN: A03-0150; FootprintStatus: 'Active (Verified)'
P1 = A08-0838: UFL (Small Coax Connector); PartGroup: Mechanical devices,Connectors,Coaxial; Manufacturer: HIROSE; ComponentStatus: 'Active (verified)'; AN: A08-0838; Height: 1.25; MPN: U.FL-R-SMT-1(10); FootprintStatus: 'Active (Verified)'
Q1 = A05-0051: Dual N-Channel MOSFET, 60V, 115mA cont,RDS(ON) < 7.5 Ohm @50mA@5V, SOT-363; PartGroup: Transistors,Small signal FET,SMD; Manufacturer: Fairchild; TemperatureRange: -65 to 150 deg C; ComponentStatus: 'Active (verified)'; Status: New; AN: A05-0051; Height: 1.10000002384186; MPN: 2N7002DW; FootprintStatus: 'Active (Verified)'
R1 R5 = A02-0284: Thick film resistor, SMD 0402, 1/16W, 1%; PartGroup: Resistors,SMD,0402 1%; TemperatureRange: -55 - +125 deg C; ComponentStatus: 'Active (verified)'; Status: Active; Verified by: Lars Helge Mo; Verified date: 2005-12-19; AN: A02-0284; Tolerance: 1 %; Height: 0.349999994039536; FootprintStatus: 'Active (Verified)'
R2 R3 = A02-0200: Thick film resistor, SMD 0402, 1/16W, 1%; PartGroup: Resistors,SMD,0402 1%; TemperatureRange: -55 - +125 deg C; ComponentStatus: 'Active (verified)'; Status: Active; Verified by: Lars Helge Mo; Verified date: 2005-12-19; AN: A02-0200; Tolerance: 1 %; Height: 0.349999994039536; FootprintStatus: 'Active (Verified)'
R4 R9 = A02-0553: Thick film resistor, SMD 0201, 1/20W, 5%; PartGroup: Resistors,SMD,0201 5%; Manufacturer: ROHM; MPN: MCR006YZPJ000; ComponentStatus: 'Active (verified)'; Status: Active; Verified by: Lars Helge Mo; Verified date: 2005-12-19; AN: A02-0553; Tolerance: 5%; FootprintStatus: 'Active (Verified)'
R6 = A02-0260: as R100 on sheet REB215_XPRO_A_Connector; Status: Active; Verified by: Lars Helge Mo; Verified date: 2005-12-19; AN: A02-0260; Tolerance: 1 %; Height: 0.349999994039536; FootprintStatus: 'Active (Verified)'
R7 = A02-0677: RES 100K OHM 1/20W 5% 0201 SMD; PartGroup: Resistors,SMD,0201 5%; Manufacturer: YAGEO CORP; MPN: RC0201JR-07100KL; ComponentStatus: 'Active (verified)'; Status: Active; Verified by: Lars Helge Mo; Verified date: 2005-12-19; AN: A02-0677; FootprintStatus: 'Active (Verified)'
R8 = A02-0178: Thick film resistor, SMD 0402, 1/16W, 1%; PartGroup: Resistors,SMD,0402 1%; TemperatureRange: -55 - +125 deg C; ComponentStatus: 'Active (verified)'; Status: Active; Verified by: Lars Helge Mo; Verified date: 2005-12-19; AN: A02-0178; Tolerance: 1 %; Height: 0.349999994039536; FootprintStatus: 'Active (Verified)'
R10 R11 R13 = A02-0541: Thick film resistor, SMD 0201, 1/20W, 5%; PartGroup: Resistors,SMD,0201 5%; Manufacturer: ROHM; MPN: MCR006YZPJ103+; ComponentStatus: 'Active (verified)'; Status: Active; Verified by: Lars Helge Mo; Verified date: 2005-12-19; AN: A02-0541; Tolerance: 5%; FootprintStatus: 'Active (Verified)'
R12 = A02-0196: Thick film resistor, SMD 0402, 1/16W, 1%; PartGroup: Resistors,SMD,0402 1%; TemperatureRange: -55 - +125 deg C; ComponentStatus: 'Active (verified)'; Status: Active; Verified by: Lars Helge Mo; Verified date: 2005-12-19; AN: A02-0196; Tolerance: 1 %; Height: 0.349999994039536; FootprintStatus: 'Active (Verified)'
R101 R102 = A02-0236: Thick film resistor, SMD 0402, 1/16W, 1%; PartGroup: Resistors,SMD,0402 1%; Manufacturer: vishay; MPN: CRCW040210K0FKED; TemperatureRange: -55 - +125 deg C; ComponentStatus: 'Active (verified)'; Status: Active; Verified by: Lars Helge Mo; Verified date: 2005-12-19; AN: A02-0236; Tolerance: 1 %; Height: 0.349999994039536; FootprintStatus: 'Active (Verified)'
SMA1 SMA2 = A08-1047: End Launch Jack Receptacle, Round Contact (de21535); PartGroup: Mechanical devices,Connectors,Coaxial; Manufacturer: EMERSON; ComponentStatus: 'Active (verified)'; AN: A08-1047; MPN: 142-0711-821; FootprintStatus: 'New (Not verified)'
SW1 = A08-0790: SWITCH, SMD, 2.45N, 6.2mm X 6.2mm; PartGroup: Mechanical devices,Switches,SMD; Manufacturer: ALPS; TemperatureRange: -30 - +90 deg C; ComponentStatus: 'Active (verified)'; Status: Active; Verified by: Ketil Skjerve; Verified date: 2006-03-15; AN: A08-0790; Height: 5.09999990463257; MPN: SKRAAKE010; FootprintStatus: 'Active (Verified)'
TP1 TP2 TP4 TP10-TP13 = A08-0892: Single SMD testpad; PartGroup: Mechanical devices,Other; ComponentStatus: 'New (not verified)'; Status: Active; Verified by: Sveinung Helgeland; Verified date: 2006-02-17; AN: A08-0892; Height: 0; FootprintStatus: 'Active (Verified)'
TP8 TP9 = A08-1716: THM Test Point, Without Base, 1.0mm Dia. Mounting; PartGroup: Mechanical devices,Other; Manufacturer: Keystone Corp.; Value: 5012; ComponentStatus: 'Obsolete'; Status: Active; Verified by: Sveinung Helgeland; Verified date: 2006-02-17; AN: A08-1716; Height: 2.5; MPN: 5012; FootprintStatus: 'New (Not verified)'
U1 = A06-0976: Sub-1GHz/2.4GHz Transceiver; PartGroup: Integrated Circuits,Interface ICs,RF; Manufacturer: ATMEL; Value: AT86RF215-ZU; TemperatureRange: -40Â°C to +85Â°C; ComponentStatus: 'Active (verified)'; AN: A06-0976; MPN: AT86RF215-ZU; FootprintStatus: 'New (Not verified)'
U2 = A06-0871: IC EEPROM 2KBIT 1MHz, 1.7V to 5.5V, SOT23-5; PartGroup: Integrated Circuits,Memory,EEPROM; Manufacturer: ATMEL; ComponentStatus: 'Active (verified)'; Status: *; Design comment: *; Verified by: *; Verified date: *; AN: A06-0871; Height: 1.10000002384186; MPN: AT24MAC602-STUM-T; FootprintStatus: 'Active (Verified)'
XC1 = A07-0087: 26MHz TCXO, 2.8 ~ 3.3V, Clipped sine wave 10KOhm/10pF, 3.2 x 2.5 mm SMD; PartGroup: Frequency devices,Crystals,SMD; Manufacturer: Taiway Electronics; Tolerance: +/-2ppm; TemperatureRange: -20  to  +70Â°C; ComponentStatus: 'Active (verified)'; AN: A07-0087; MPN: TXETCCSANF-26.0000; FootprintStatus: 'Active (Verified)'

## Nets that join several sheets
GND: REB215_XPRO_A_Connector (22 pins), REB215_XPRO_A_RF (56 pins)
VCC_TARGET: REB215_XPRO_A_Connector (C101.1 J100.20), REB215_XPRO_A_RF (9 pins)
ID_SCL: REB215_XPRO_A_Connector (J100.12), REB215_XPRO_A_RF (R102.1 TP10.1 U2.1)
ID_SDA: REB215_XPRO_A_Connector (J100.11), REB215_XPRO_A_RF (R101.1 TP11.1 U2.3)
NetC6_1: REB215_XPRO_A_Connector (J100.7), REB215_XPRO_A_RF (C6.1 R6.1 R8.2 U1.13)
NetJ100_5: REB215_XPRO_A_Connector (J100.5), REB215_XPRO_A_RF (Q1.5 R5.1 TP12.1)
NetJ100_6: REB215_XPRO_A_Connector (J100.6), REB215_XPRO_A_RF (Q1.2 R1.1 TP13.1)
NetJ100_9: REB215_XPRO_A_Connector (J100.9), REB215_XPRO_A_RF (U1.40)
NetJ100_15: REB215_XPRO_A_Connector (J100.15), REB215_XPRO_A_RF (U1.42)
NetJ100_16: REB215_XPRO_A_Connector (J100.16), REB215_XPRO_A_RF (U1.43)
NetJ100_17: REB215_XPRO_A_Connector (J100.17), REB215_XPRO_A_RF (U1.44)
NetJ100_18: REB215_XPRO_A_Connector (J100.18), REB215_XPRO_A_RF (U1.41)
NetJ104_1: REB215_XPRO_A_Connector (J104.1), REB215_XPRO_A_RF (U1.2)
NetJ104_2: REB215_XPRO_A_Connector (J104.2), REB215_XPRO_A_RF (U1.1)
NetJ105_1: REB215_XPRO_A_Connector (J105.1), REB215_XPRO_A_RF (U1.12)
NetJ105_2: REB215_XPRO_A_Connector (J105.2), REB215_XPRO_A_RF (U1.11)
RXCLK_N: REB215_XPRO_A_Connector (J101.6), REB215_XPRO_A_RF (U1.33)
RXCLK_P: REB215_XPRO_A_Connector (J101.5), REB215_XPRO_A_RF (U1.34)
RXD09_N: REB215_XPRO_A_Connector (J102.3), REB215_XPRO_A_RF (U1.30)
RXD09_P: REB215_XPRO_A_Connector (J102.2), REB215_XPRO_A_RF (U1.31)
RXD24_N: REB215_XPRO_A_Connector (J101.3), REB215_XPRO_A_RF (U1.35)
RXD24_P: REB215_XPRO_A_Connector (J101.2), REB215_XPRO_A_RF (U1.36)
TXCLK_N: REB215_XPRO_A_Connector (J103.6), REB215_XPRO_A_RF (U1.25)
TXCLK_P: REB215_XPRO_A_Connector (J103.5), REB215_XPRO_A_RF (U1.26)
TXD_N: REB215_XPRO_A_Connector (J103.3), REB215_XPRO_A_RF (U1.27)
TXD_P: REB215_XPRO_A_Connector (J103.2), REB215_XPRO_A_RF (U1.28)

## Assembly variants
Default_assembly: not fitted C4 C7 C21 C22 FR1
ID powered through VTG: not fitted C4 C7 C21 C22 FR1 TP1 TP4 TP8 TP9 TP10 TP11 TP12 TP13